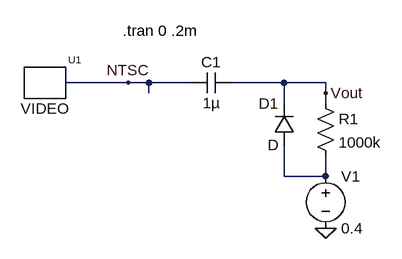
[diagram p0: schematic DC_rectifier.asc]
DC_rectifier.asc, the LTspice schematic file:
Version 4
SHEET 1 880 680
WIRE 208 256 112 256
WIRE 240 256 208 256
WIRE 304 256 240 256
WIRE 448 256 368 256
WIRE 512 256 448 256
WIRE 240 272 240 256
WIRE 512 272 512 256
WIRE 448 288 448 256
WIRE 512 288 512 272
WIRE 448 400 448 352
WIRE 512 400 512 368
WIRE 512 400 448 400
FLAG 512 480 0
FLAG 512 272 Vout
FLAG 208 256 NTSC
SYMBOL cap 368 240 R90
WINDOW 0 0 32 VBottom 2
WINDOW 3 32 32 VTop 2
SYMATTR InstName C1
SYMATTR Value 1µ
SYMBOL res 496 272 R0
SYMATTR InstName R1
SYMATTR Value 1000k
SYMBOL diode 464 352 R180
WINDOW 0 24 64 Left 2
WINDOW 3 24 0 Left 2
SYMATTR InstName D1
SYMBOL VIDEO_NTSC 80 256 R0
SYMATTR InstName U1
SYMBOL voltage 512 384 R0
SYMATTR InstName V1
SYMATTR Value 0.4
TEXT 200 176 Left 2 !.tran 0 .2m

The netlist it stands for:
* DC_rectifier.asc
C1 Vout NTSC 1µ
R1 Vout N001 1000k
D1 N001 Vout D
XU1 NTSC VIDEO  ; pins 64
V1 N001 0 0.4
.model D D
.lib standard.dio
.tran 0 .2m
.lib source.lib
.backanno
.end